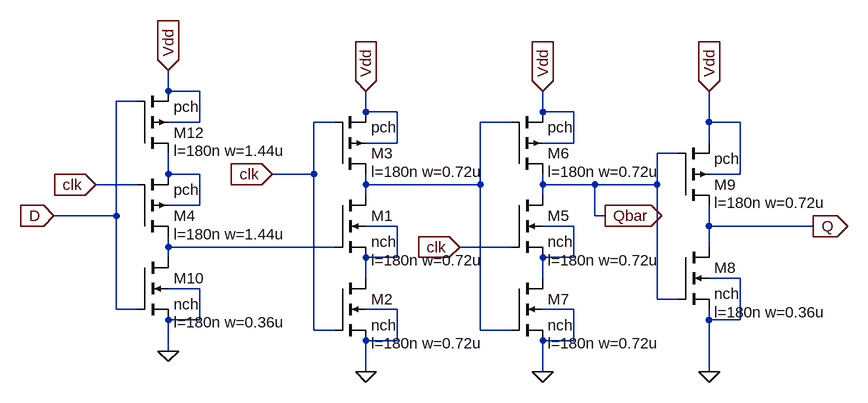
[diagram p0: schematic dff_sym.asc]
dff_sym.asc, the LTspice schematic file:
Version 4
SHEET 1 1948 680
WIRE 752 -96 752 -128
WIRE 800 -96 752 -96
WIRE 704 -80 672 -80
WIRE 1056 -64 1056 -96
WIRE 1104 -64 1056 -64
WIRE 1328 -64 1328 -96
WIRE 1376 -64 1328 -64
WIRE 800 -48 800 -96
WIRE 800 -48 752 -48
WIRE 1008 -48 976 -48
WIRE 1280 -48 1232 -48
WIRE 1584 -48 1584 -96
WIRE 1632 -48 1584 -48
WIRE 1104 -16 1104 -64
WIRE 1104 -16 1056 -16
WIRE 1376 -16 1376 -64
WIRE 1376 -16 1328 -16
WIRE 1584 -16 1584 -48
WIRE 1536 0 1504 0
WIRE 752 32 752 0
WIRE 800 32 752 32
WIRE 976 32 976 -48
WIRE 976 32 912 32
WIRE 1632 32 1632 -48
WIRE 1632 32 1584 32
WIRE 704 48 640 48
WIRE 1056 48 1056 32
WIRE 1232 48 1232 -48
WIRE 1232 48 1056 48
WIRE 1328 48 1328 32
WIRE 1408 48 1328 48
WIRE 1504 48 1504 0
WIRE 1504 48 1408 48
WIRE 1056 64 1056 48
WIRE 1328 64 1328 48
WIRE 800 80 800 32
WIRE 800 80 752 80
WIRE 672 96 672 -80
WIRE 672 96 576 96
WIRE 1408 96 1408 48
WIRE 1424 96 1408 96
WIRE 1104 112 1056 112
WIRE 1376 112 1328 112
WIRE 1584 112 1584 80
WIRE 1744 112 1584 112
WIRE 752 144 752 128
WIRE 1008 144 752 144
WIRE 1280 144 1200 144
WIRE 1584 144 1584 112
WIRE 752 160 752 144
WIRE 1104 160 1104 112
WIRE 1104 160 1056 160
WIRE 1376 160 1376 112
WIRE 1376 160 1328 160
WIRE 1056 192 1056 160
WIRE 1328 192 1328 160
WIRE 1632 192 1584 192
WIRE 800 208 752 208
WIRE 1504 224 1504 48
WIRE 1536 224 1504 224
WIRE 672 240 672 96
WIRE 704 240 672 240
WIRE 1104 240 1056 240
WIRE 1376 240 1328 240
WIRE 800 256 800 208
WIRE 800 256 752 256
WIRE 1584 256 1584 240
WIRE 1632 256 1632 192
WIRE 1632 256 1584 256
WIRE 976 272 976 32
WIRE 1008 272 976 272
WIRE 1232 272 1232 48
WIRE 1280 272 1232 272
WIRE 1104 288 1104 240
WIRE 1104 288 1056 288
WIRE 1376 288 1376 240
WIRE 1376 288 1328 288
WIRE 752 304 752 256
WIRE 1056 336 1056 288
WIRE 1328 336 1328 288
WIRE 1584 336 1584 256
FLAG 752 304 0
FLAG 1056 336 0
FLAG 1328 336 0
FLAG 640 48 clk
IOPIN 640 48 In
FLAG 1744 112 Q
IOPIN 1744 112 Out
FLAG 1584 336 0
FLAG 576 96 D
IOPIN 576 96 In
FLAG 912 32 clk
IOPIN 912 32 In
FLAG 1200 144 clk
IOPIN 1200 144 In
FLAG 752 -128 Vdd
IOPIN 752 -128 In
FLAG 1056 -96 Vdd
IOPIN 1056 -96 In
FLAG 1328 -96 Vdd
IOPIN 1328 -96 In
FLAG 1584 -96 Vdd
IOPIN 1584 -96 In
FLAG 1424 96 Qbar
IOPIN 1424 96 Out
SYMBOL pmos4 704 0 M180
WINDOW 123 56 4 Left 2
SYMATTR Value2 l=180n w=1.44u
SYMATTR InstName M12
SYMATTR Value pch
SYMBOL pmos4 1008 32 M180
WINDOW 123 56 4 Left 2
SYMATTR Value2 l=180n w=0.72u
SYMATTR InstName M3
SYMATTR Value pch
SYMBOL pmos4 1280 32 M180
WINDOW 123 56 4 Left 2
SYMATTR Value2 l=180n w=0.72u
SYMATTR InstName M6
SYMATTR Value pch
SYMBOL pmos4 1536 80 M180
WINDOW 123 56 4 Left 2
SYMATTR Value2 l=180n w=0.72u
SYMATTR InstName M9
SYMATTR Value pch
SYMBOL pmos4 704 128 M180
WINDOW 123 56 4 Left 2
SYMATTR Value2 l=180n w=1.44u
SYMATTR InstName M4
SYMATTR Value pch
SYMBOL nmos4 704 160 R0
WINDOW 123 56 100 Left 2
SYMATTR Value2 l=180n w=0.36u
SYMATTR InstName M10
SYMATTR Value nch
SYMBOL nmos4 1008 64 R0
WINDOW 123 56 100 Left 2
SYMATTR Value2 l=180n w=0.72u
SYMATTR InstName M1
SYMATTR Value nch
SYMBOL nmos4 1008 192 R0
WINDOW 123 56 100 Left 2
SYMATTR Value2 l=180n w=0.72u
SYMATTR InstName M2
SYMATTR Value nch
SYMBOL nmos4 1280 64 R0
WINDOW 123 56 100 Left 2
SYMATTR Value2 l=180n w=0.72u
SYMATTR InstName M5
SYMATTR Value nch
SYMBOL nmos4 1280 192 R0
WINDOW 123 56 100 Left 2
SYMATTR Value2 l=180n w=0.72u
SYMATTR InstName M7
SYMATTR Value nch
SYMBOL nmos4 1536 144 R0
WINDOW 123 56 100 Left 2
SYMATTR Value2 l=180n w=0.36u
SYMATTR InstName M8
SYMATTR Value nch

The netlist it stands for:
* dff_sym.asc
M12 N002 D Vdd Vdd pch l=180n w=1.44u
M3 N001 clk Vdd Vdd pch l=180n w=0.72u
M6 Qbar N001 Vdd Vdd pch l=180n w=0.72u
M9 Q Qbar Vdd Vdd pch l=180n w=0.72u
M4 N005 clk N002 N002 pch l=180n w=1.44u
M10 N005 D 0 0 nch l=180n w=0.36u
M1 N001 N005 N003 N003 nch l=180n w=0.72u
M2 N003 clk 0 0 nch l=180n w=0.72u
M5 Qbar clk N004 N004 nch l=180n w=0.72u
M7 N004 N001 0 0 nch l=180n w=0.72u
M8 Q Qbar 0 0 nch l=180n w=0.36u
.model NMOS NMOS
.model PMOS PMOS
.lib standard.mos
.backanno
.end